# EAGLE design Nodino-Base2-nosupply (EAGLE 6.5.0)
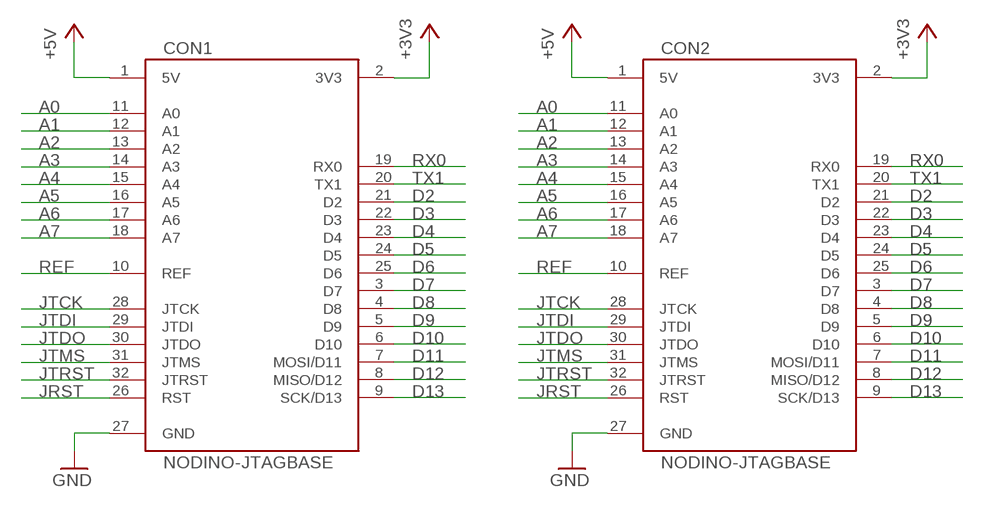
[diagram p0: schematic, sheet 1]

## Parts
CON1  NODINO-JTAGBASE  [NODINO-JTAG-BASE]
CON2  NODINO-JTAGBASE  [NODINO-JTAG-BASE]

## Nets
+3V3: CON1.2(3V3) CON2.2(3V3)
+5V: CON1.1(5V) CON2.1(5V)
A0: CON1.11(A0) CON2.11(A0)
A1: CON1.12(A1) CON2.12(A1)
A2: CON1.13(A2) CON2.13(A2)
A3: CON1.14(A3) CON2.14(A3)
A4: CON1.15(A4) CON2.15(A4)
A5: CON1.16(A5) CON2.16(A5)
A6: CON1.17(A6) CON2.17(A6)
A7: CON1.18(A7) CON2.18(A7)
D2: CON1.21(D2) CON2.21(D2)
D3: CON1.22(D3) CON2.22(D3)
D4: CON1.23(D4) CON2.23(D4)
D5: CON1.24(D5) CON2.24(D5)
D6: CON1.25(D6) CON2.25(D6)
D7: CON1.3(D7) CON2.3(D7)
D8: CON1.4(D8) CON2.4(D8)
D9: CON1.5(D9) CON2.5(D9)
D10: CON1.6(D10) CON2.6(D10)
D11: CON1.7(MOSI/D11) CON2.7(MOSI/D11)
D12: CON1.8(MISO/D12) CON2.8(MISO/D12)
D13: CON1.9(SCK/D13) CON2.9(SCK/D13)
GND: CON1.27(GND) CON2.27(GND)
JRST: CON1.26(RST) CON2.26(RST)
JTCK: CON1.28(JTCK) CON2.28(JTCK)
JTDI: CON1.29(JTDI) CON2.29(JTDI)
JTDO: CON1.30(JTDO) CON2.30(JTDO)
JTMS: CON1.31(JTMS) CON2.31(JTMS)
JTRST: CON1.32(JTRST) CON2.32(JTRST)
REF: CON1.10(REF) CON2.10(REF)
RX0: CON1.19(RX0) CON2.19(RX0)
TX1: CON1.20(TX1) CON2.20(TX1)

## Library data of the parts
CON1 CON2 = nodino:NODINO-JTAG

## Board
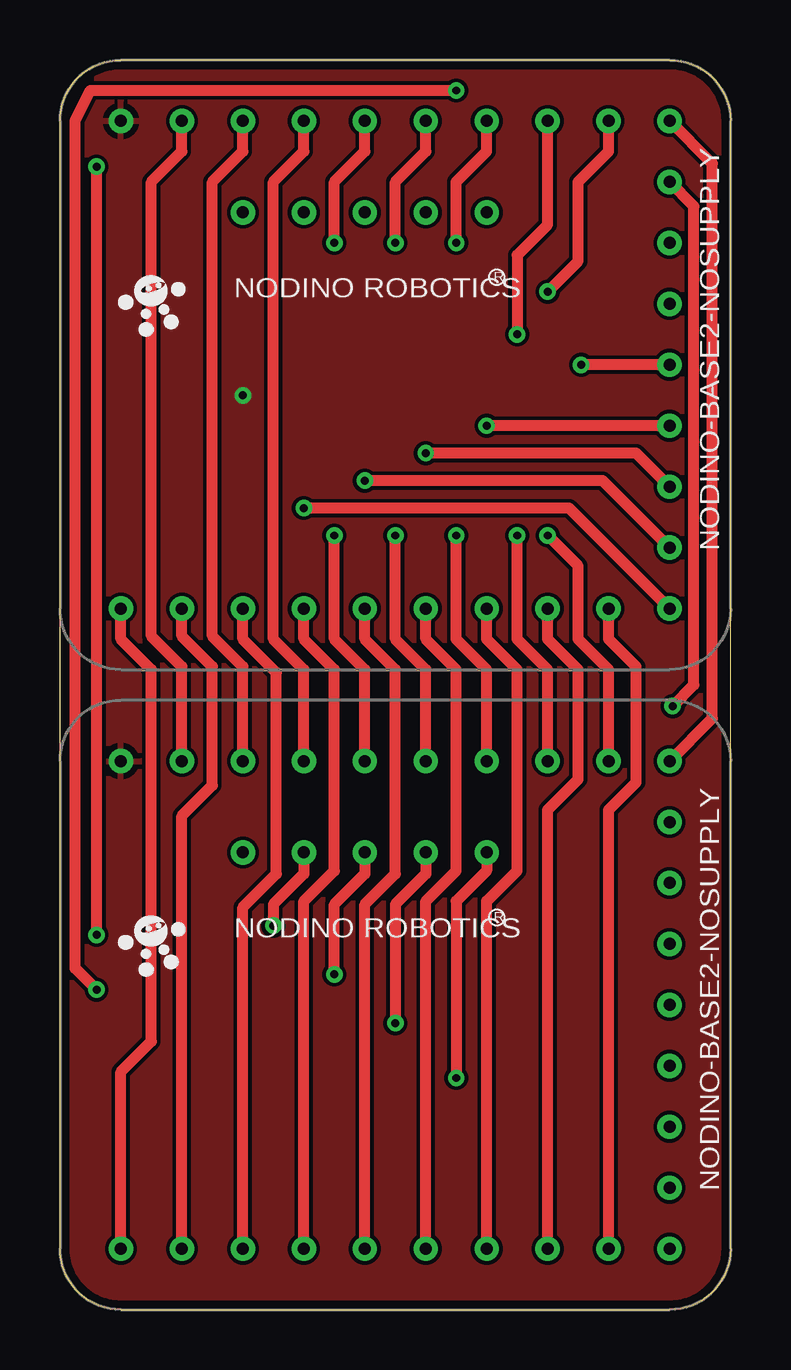
[diagram p1: board, top side]
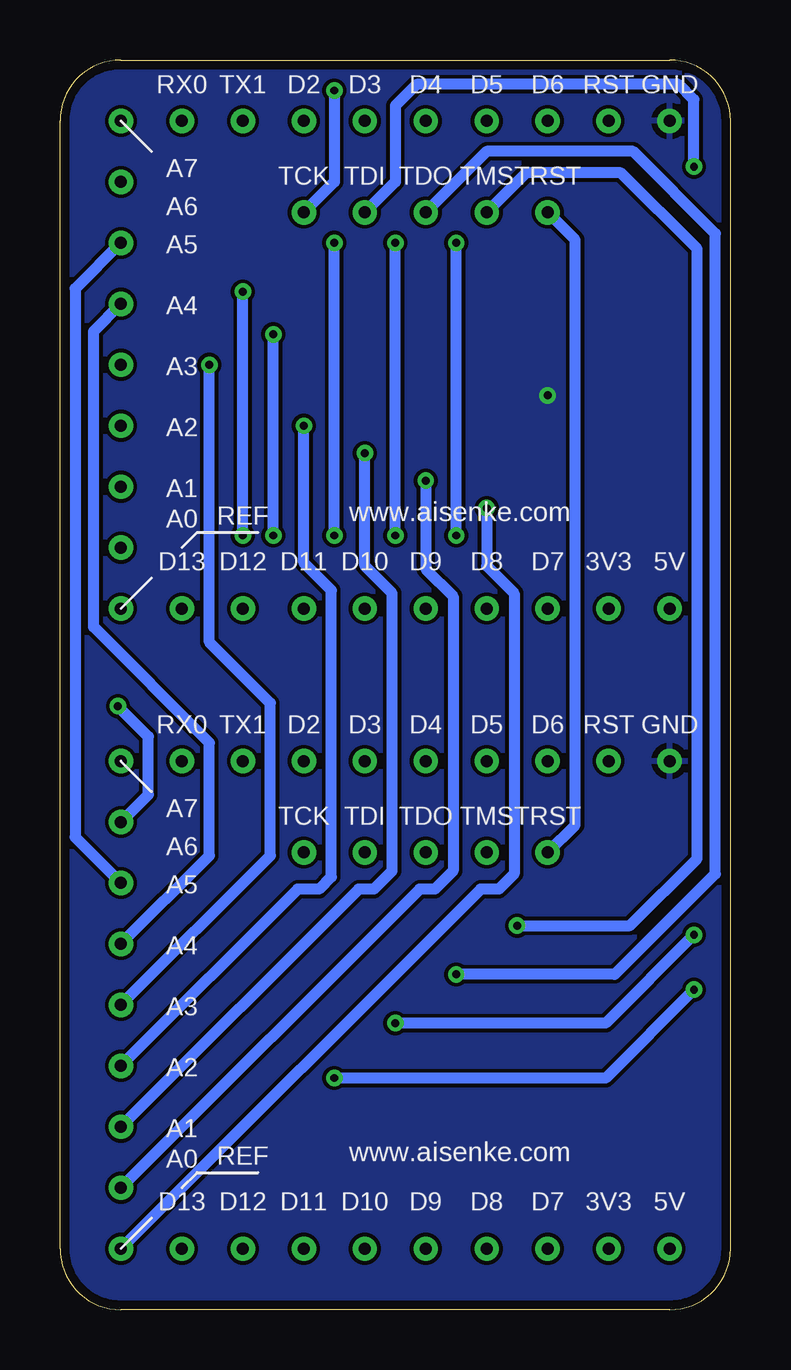
[diagram p2: board, bottom side, seen from below]

Size 27.94 x 52.07 mm. Coordinates in mm from the lower left corner, seen from the top.
Outline: 0,2.54 0,49.53 arc-90 2.54,52.07 25.4,52.07 arc-90 27.94,49.53 27.94,2.54 arc-90 25.4,0 2.54,0 arc-90 0,2.54
Copper layers (1*16): Top 0.0356mm / dielectric 1.5011mm / Bottom 0.0356mm
Design rules "LaenPCBOrder": minimum track width 6mil, minimum drill 13mil, track to track 6mil, track to pad 6mil, pad to pad 6mil, via to via 6mil, smd to smd 6mil, copper to edge 15mil, drill to drill 6mil, minimum pad ring 7mil, minimum via ring 7mil, stop-mask expansion 3mil, vias tented up to drill 0mil, thermal gap 10mil

### Footprints (pad centres in the part's own frame; a part is rotated, then mirrored left to right if it is on the bottom)
NODINO-JTAG-BASE = drill 0.5 pad 1.016: 1 -11.43,-10.16; 2 -8.89,-10.16; 3 -6.35,-10.16; 4 -3.81,-10.16; 5 -1.27,-10.16; 6 1.27,-10.16; 7 3.81,-10.16; 8 6.35,-10.16; 9 8.89,-10.16; 10 11.43,-10.16; 11 11.43,-7.62; 12 11.43,-5.08; 13 11.43,-2.54; 14 11.43,0; 15 11.43,2.54; 16 11.43,5.08; 17 11.43,7.62; 18 11.43,10.16; 19 8.89,10.16; 20 6.35,10.16; 21 3.81,10.16; 22 1.27,10.16; 23 -1.27,10.16; 24 -3.81,10.16; 25 -6.35,10.16; 26 -8.89,10.16; 27 -11.43,10.16; 28 3.81,6.35; 29 1.27,6.35; 30 -1.27,6.35; 31 -3.81,6.35; 32 -6.35,6.35

### Placement (x,y rotation side)
CON1  13.97,12.7 0 top
CON2  13.97,39.37 0 top

### Tracks (layer width: path | path; a pad name or v marks a point on that pad's centre or on a via)
+3V3
  Top 0.457: CON1.2 5.08,20.57 6.35,21.84 6.35,26.8 5.08,28.07 CON2.2
+5V
  Top 0.457: CON1.1 2.54,9.91 3.81,11.18 3.81,26.67 2.54,27.94 CON2.1
A0  (via drill 0.33)
  Top 0.457: CON2.11 22.61,34.54 v12.7,34.54
  Bottom 0.457: v12.7,34.54 12.7,30.86 11.56,29.72 11.56,18.29 12.32,17.53 12.95,17.53 CON1.11
A1  (via drill 0.33)
  Top 0.457: CON2.12 24,35.69 v15.24,35.69
  Bottom 0.457: v15.24,35.69 15.24,30.99 14.1,29.84 14.1,18.29 14.86,17.53 15.49,17.53 CON1.12
A2  (via drill 0.33)
  Top 0.457: CON2.13 v17.78,36.83
  Bottom 0.457: v17.78,36.83 17.78,31.11 16.64,29.97 16.64,18.03 17.14,17.53 18.03,17.53 CON1.13
A3  (via drill 0.33)
  Top 0.457: CON2.14 v21.72,39.37
  Bottom 0.457: CON1.14 19.18,18.92 19.18,25.27 21.72,27.81 v21.72,39.37
A4
  Bottom 0.457: CON1.15 21.72,18.92 21.72,23.62 26.54,28.45 26.54,40.77 CON2.15
A5
  Bottom 0.457: CON2.16 27.3,42.55 27.3,19.68 CON1.16
A6  (via drill 0.33)
  Top 0.457: v25.53,25.15 26.42,26.04 26.42,45.97 CON2.17
  Bottom 0.457: CON1.17 24.26,21.46 24.26,23.88 v25.53,25.15
A7
  Top 0.457: CON1.18 27.18,24.64 27.18,47.75 CON2.18
D2  (via drill 0.33)
  Top 0.457: CON1.21 17.78,26.67 16.51,27.94 v16.51,32.26 | CON2.21 17.78,48.26 16.51,46.99 v16.51,44.45
  Bottom 0.457: v16.51,32.26 v16.51,44.45
D3  (via drill 0.33)
  Top 0.457: CON1.22 15.24,26.67 13.97,27.94 v13.97,32.26 | CON2.22 15.24,48.26 13.97,46.99 v13.97,44.45
  Bottom 0.457: v13.97,32.26 v13.97,44.45
D4  (via drill 0.33)
  Top 0.457: CON1.23 12.7,26.67 11.43,27.94 v11.43,32.26 | CON2.23 12.7,48.26 11.43,46.99 v11.43,44.45
  Bottom 0.457: v11.43,32.26 v11.43,44.45
D5
  Top 0.457: CON1.24 10.16,26.67 8.89,27.94 8.89,46.99 10.16,48.26 CON2.24
D6
  Top 0.457: CON1.25 7.62,26.8 6.35,28.07 6.35,46.99 7.62,48.26 CON2.25
D7
  Top 0.457: CON1.3 7.62,16.76 9.02,18.16 9.02,26.54 7.62,27.94 CON2.3
D8
  Top 0.457: CON1.4 10.16,17.02 11.43,18.29 11.43,26.67 10.16,27.94 CON2.4
D9
  Top 0.457: CON1.5 12.7,16.89 13.97,18.16 13.97,26.67 12.7,27.94 CON2.5
D10
  Top 0.457: CON1.6 15.24,17.02 16.51,18.29 16.51,26.67 15.24,27.94 CON2.6
D11
  Top 0.457: CON1.7 17.78,17.02 19.05,18.29 19.05,26.67 17.78,27.94 CON2.7
D12
  Top 0.457: CON1.8 20.32,20.83 21.59,22.1 21.59,26.67 20.32,27.94 CON2.8
D13
  Top 0.457: CON1.9 22.86,20.83 24,21.97 24,26.8 22.86,27.94 CON2.9
GND  (via drill 0.33)
  other vias: 7.62,38.1
  pour Top: 0,52.07 27.94,52.07 27.94,0 0,0
  pour Bottom: 0,52.07 27.94,52.07 27.94,0 0,0
JRST
  Top 0.457: CON1.26 5.08,26.8 3.81,28.07 3.81,46.99 5.08,48.26 CON2.26
JTCK  (via drill 0.33)
  Top 0.457: v1.52,13.34 0.64,14.22 0.64,49.53 1.27,50.8 v16.51,50.8 | CON1.28 17.78,18.29 16.51,17.02 v16.51,9.65
  Bottom 0.457: v16.51,50.8 16.51,46.99 CON2.28 | v1.52,13.34 5.21,9.65 v16.51,9.65
JTDI  (via drill 0.33)
  Top 0.457: v1.52,15.62 v1.52,47.62 | CON1.29 15.24,18.16 13.97,16.89 v13.97,11.94
  Bottom 0.457: v1.52,47.62 1.52,50.42 2.16,51.05 13.08,51.05 13.97,50.16 13.97,46.99 CON2.29 | v1.52,15.62 5.21,11.94 v13.97,11.94
JTDO  (via drill 0.33)
  Top 0.457: CON1.30 12.7,18.16 11.43,16.89 v11.43,13.97
  Bottom 0.457: CON2.30 10.16,48.26 4.06,48.26 0.64,44.83 0.64,18.16 4.83,13.97 v11.43,13.97
JTMS  (via drill 0.33)
  Top 0.457: CON1.31 10.16,18.16 8.89,16.89 v8.89,16
  Bottom 0.457: CON2.31 8.51,47.37 4.57,47.37 1.4,44.2 1.4,18.8 4.19,16 v8.89,16
JTRST
  Bottom 0.457: CON1.32 6.48,20.19 6.48,44.58 CON2.32
REF  (via drill 0.33)
  Top 0.457: CON2.10 21.21,33.4 v10.16,33.4
  Bottom 0.457: v10.16,33.4 10.16,30.99 9.02,29.84 9.02,18.16 9.65,17.53 10.41,17.53 CON1.10
RX0  (via drill 0.33)
  Top 0.457: CON1.19 22.86,26.67 21.59,27.94 21.59,30.99 v20.32,32.26 | CON2.19 22.86,48.26 21.59,46.99 21.59,43.69 v20.32,42.42
  Bottom 0.457: v20.32,32.26 v20.32,42.42
TX1  (via drill 0.33)
  Top 0.457: CON1.20 20.32,26.67 19.05,27.94 v19.05,32.26 | CON2.20 20.32,45.21 19.05,43.94 v19.05,40.64
  Bottom 0.457: v19.05,32.26 v19.05,40.64

### Text on the board
tPlace: R | NODINO ROBOTICS | NODINO-BASE2-NOSUPPLY | NODINO ROBOTICS | R | NODINO-BASE2-NOSUPPLY
bPlace: www.aisenke.com | www.aisenke.com